# Altium schematic sheet MainBoard.SchDoc
size B
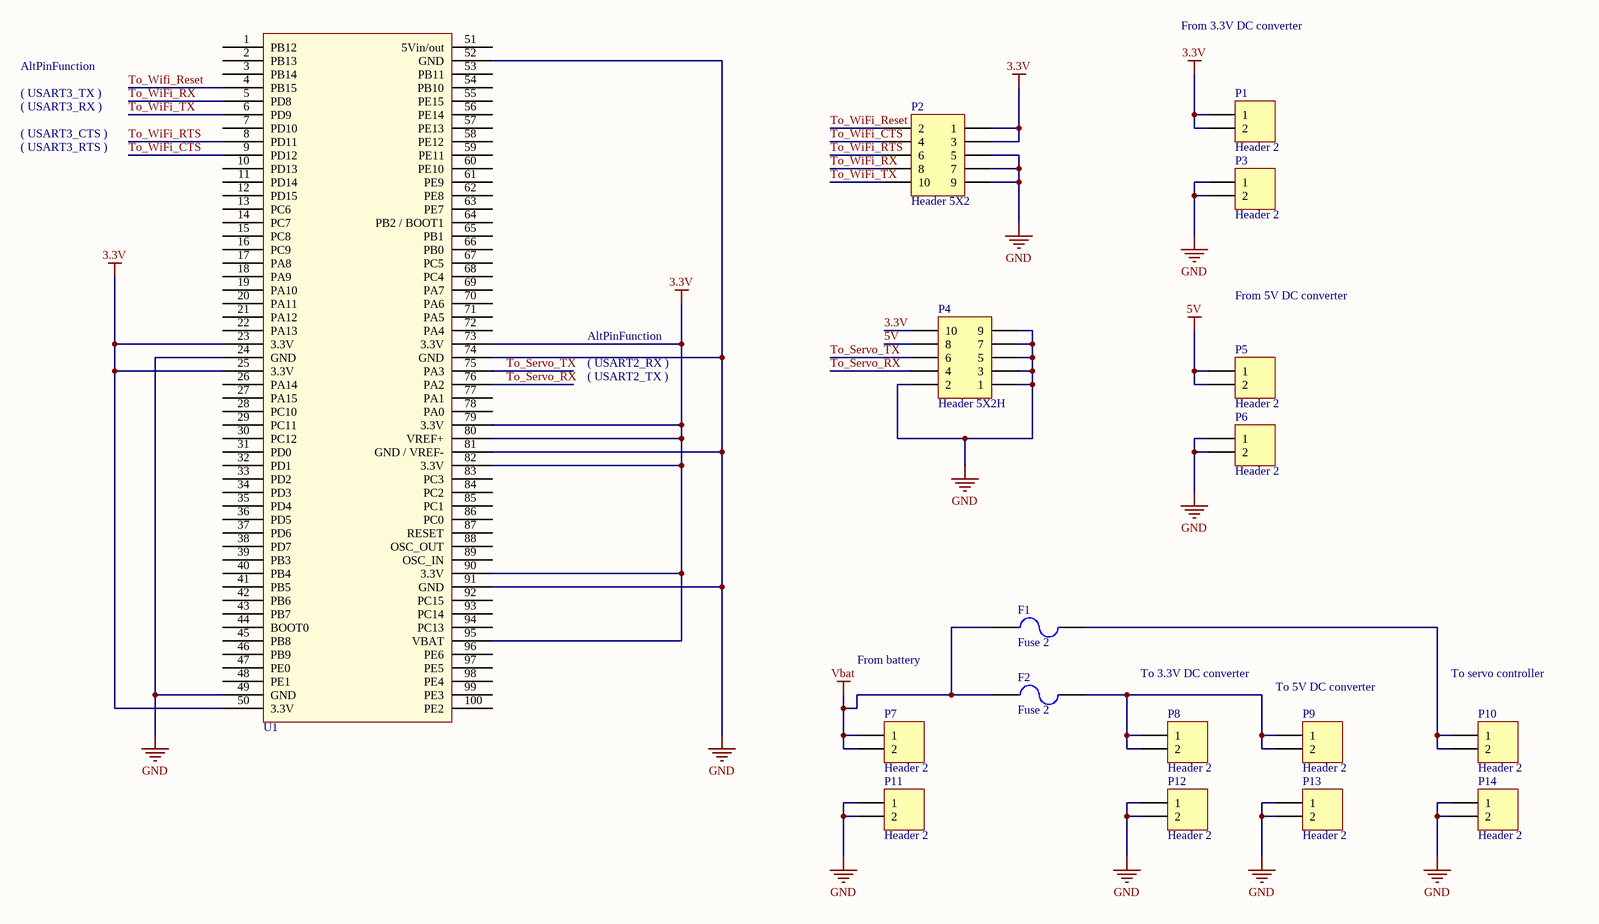
[diagram p0: MainBoard.SchDoc]

## Parts
F1  Fuse 2  [PIN-W2/E2.8]
F2  Fuse 2  [PIN-W2/E2.8]
P1  Header 2  [HDR1X2]
P2  Header 5X2  [HDR2X5]
P3  Header 2  [HDR1X2]
P4  Header 5X2H  [HDR2X5H]
P5  Header 2  [HDR1X2]
P6  Header 2  [HDR1X2]
P7  Header 2  [HDR1X2]
P8  Header 2  [HDR1X2]
P9  Header 2  [HDR1X2]
P10  Header 2  [HDR1X2]
P11  Header 2  [HDR1X2]
P12  Header 2  [HDR1X2]
P13  Header 2  [HDR1X2]
P14  Header 2  [HDR1X2]
U1  STM32F207VCT6_Module  [STM32F207VCT6_Module]  (value not drawn)

## Nets
3.3V: P1.1 P1.2 P2.1 P2.3 P4.10 U1.23(3.3V) U1.25(3.3V) U1.50(3.3V) U1.73(3.3V) U1.79(3.3V) U1.80(VREF+) U1.82(3.3V) U1.90(3.3V) U1.95(VBAT)
5V: P4.8 P5.1 P5.2
GND: P2.5 P2.7 P2.9 P3.1 P3.2 P4.1 P4.2 P4.3 P4.5 P4.7 P4.9 P6.1 P6.2 P11.1 P11.2 P12.1 P12.2 P13.1 P13.2 P14.1 P14.2 U1.24(GND) U1.49(GND) U1.52(GND) U1.74(GND) U1.81(GND_/_VREF-) U1.91(GND)
Vbat: F1.1 F2.1 P7.1 P7.2
To_Servo_RX: P4.4 U1.76(PA2)
To_Servo_TX: P4.6 U1.75(PA3)
To_WiFi_CTS: P2.4 U1.9(PD12)
To_WiFi_Reset: P2.2 U1.4(PB15)
To_WiFi_RTS: P2.6 U1.8(PD11)
To_WiFi_RX: P2.8 U1.5(PD8)
To_WiFi_TX: P2.10 U1.6(PD9)
NetF1_2: F1.2 P10.1 P10.2
NetF2_2: F2.2 P8.1 P8.2 P9.1 P9.2

Not connected (* = marked no-connect by the designer): U1 1(PB12) 2(PB13) 3(PB14) 7(PD10) 10(PD13) 11(PD14) 12(PD15) 13(PC6) 14(PC7) 15(PC8) 16(PC9) 17(PA8) 18(PA9) 19(PA10) 20(PA11) 21(PA12) 22(PA13) 26(PA14) 27(PA15) 28(PC10) 29(PC11) 30(PC12) 31(PD0) 32(PD1) 33(PD2) 34(PD3) 35(PD4) 36(PD5) 37(PD6) 38(PD7) 39(PB3) 40(PB4) 41(PB5) 42(PB6) 43(PB7) 44(BOOT0) 45(PB8) 46(PB9) 47(PE0) 48(PE1) 51(5Vin/out) 53(PB11) 54(PB10) 55(PE15) 56(PE14) 57(PE13) 58(PE12) 59(PE11) 60(PE10) 61(PE9) 62(PE8) 63(PE7) 64(PB2_/_BOOT1) 65(PB1) 66(PB0) 67(PC5) 68(PC4) 69(PA7) 70(PA6) 71(PA5) 72(PA4) 77(PA1) 78(PA0) 83(PC3) 84(PC2) 85(PC1) 86(PC0) 87(RESET) 88(OSC_OUT) 89(OSC_IN) 92(PC15) 93(PC14) 94(PC13) 96(PE6) 97(PE5) 98(PE4) 99(PE3) 100(PE2)

## Notes on the sheet
- From 3.3V DC converter
- ( USART3_TX )
- AltPinFunction
- ( USART3_RX )
- ( USART3_CTS )
- ( USART3_RTS )
- From 5V DC converter
- ( USART2_RX )
- ( USART2_TX )
- From battery
- To 3.3V DC converter
- (near P9) To 5V DC converter
- To servo controller

## Library data of the parts
F1 F2 = Fuse 2: Fuse; Published: 8-Jun-2000; LatestRevisionDate: 17-Jul-2002; LatestRevisionNote: Re-released for DXP Platform.; PackageReference: PIN-W2/E2.8; Publisher: Altium Limited; PackageDescription: Thru-Hole; 2 Leads
P1 P3 P5-P14 = Header 2: Header, 2-Pin; LatestRevisionDate: 17-Jul-2002; LatestRevisionNote: Re-released for DXP Platform.; Publisher: Altium Limited
P2 = Header 5X2: Header, 5-Pin, Dual row; LatestRevisionDate: 17-Jul-2002; LatestRevisionNote: Re-released for DXP Platform.; Publisher: Altium Limited
P4 = Header 5X2H: Header, 5-Pin, Dual row, Right Angle; LatestRevisionDate: 17-Jul-2002; LatestRevisionNote: Re-released for DXP Platform.; Publisher: Altium Limited